# EAGLE design nRF24L01-Chip-v13 (EAGLE 7.7.0)
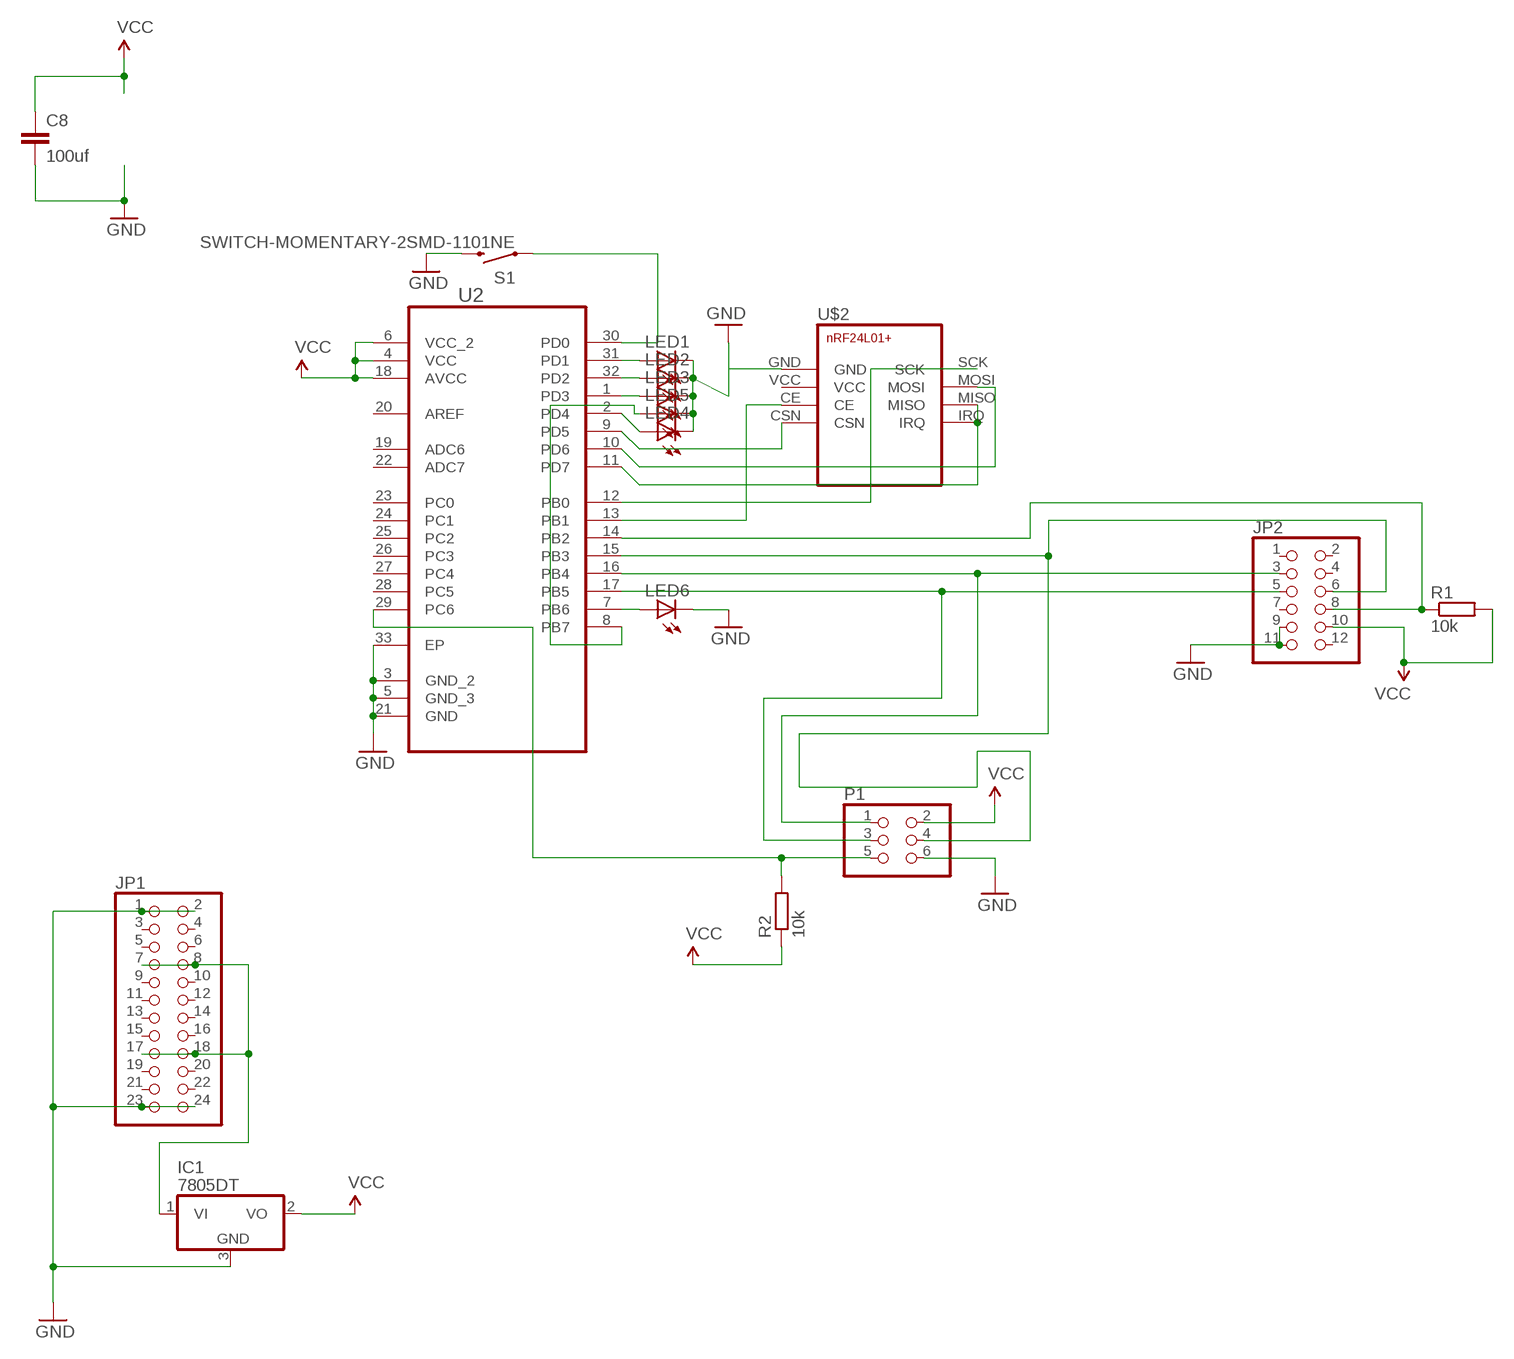
[diagram p0: schematic, sheet 1]

## Parts
C8  100uf  CAP1206  [1206]
IC1  7805DT  [TO252]
JP1  PINHD-2X12SMT  [2X12_SMT]
JP2  PINHD-2X6/90  [2X06/90]
LED1  LED1206  [LED-1206]
LED2  LED1206  [LED-1206]
LED3  LED1206  [LED-1206]
LED4  LED1206  [LED-1206]
LED5  LED1206  [LED-1206]
LED6  LED1206  [LED-1206]
P1  PINHD-2X3SMT  [2X03_SMT]
R1  10k  R-EU_R0402  [R0402]
R2  10k  R-EU_R0402  [R0402]
S1  SWITCH-MOMENTARY-2SMD-1101NE  [TACTILE-SWITCH-1101NE]
U2  ATMEGA328P-MU  [QFN50P500X500X100-33N]
U$2  NRF24L01+  [NRF24L01+]

## Nets
GND: C8.2 IC1.3(GND) JP1.1 JP1.2 JP1.23 JP1.24 JP2.9 JP2.11 LED1.C LED2.C LED3.C LED4.C LED5.C LED6.C P1.6 S1.2 U2.3(GND_2) U2.5(GND_3) U2.21(GND) U2.33(EP) U$2.GND
N$1: IC1.1(VI) JP1.7 JP1.8 JP1.17 JP1.18
N$3: U2.13(PB1) U$2.CE
N$4: U2.12(PB0) U$2.SCK
N$5: U2.11(PD7) U$2.IRQ U$2.MISO
N$6: U2.10(PD6) U$2.MOSI
N$7: U2.9(PD5) U$2.CSN
N$9: LED5.A U2.8(PB7)
N$11: JP2.5 P1.3 U2.17(PB5)
N$12: JP2.6 P1.4 U2.15(PB3)
N$13: JP2.3 P1.1 U2.16(PB4)
N$14: P1.5 R2.2 U2.29(PC6)
N$15: LED6.A U2.7(PB6)
N$16: LED4.A U2.2(PD4)
N$17: LED3.A U2.1(PD3)
N$18: LED2.A U2.32(PD2)
N$19: LED1.A U2.31(PD1)
N$20: S1.1 U2.30(PD0)
N$21: JP2.8 R1.1 U2.14(PB2)
VCC: C8.1 IC1.2(VO) JP2.10 P1.2 R1.2 R2.1 U2.4(VCC) U2.6(VCC_2) U2.18(AVCC)
Unconnected: JP1.3 JP1.4 JP1.5 JP1.6 JP1.9 JP1.10 JP1.11 JP1.12 JP1.13 JP1.14 JP1.15 JP1.16 JP1.19 JP1.20 JP1.21 JP1.22 JP2.1 JP2.2 JP2.4 JP2.7 JP2.12 U2.19(ADC6) U2.20(AREF) U2.22(ADC7) U2.23(PC0) U2.24(PC1) U2.25(PC2) U2.26(PC3) U2.27(PC4) U2.28(PC5)

## Power pins joined to a net without a drawn wire
VCC: U$2.VCC

## Library data of the parts
C8 = SparkFun-Capacitors:CAP: Capacitor Standard 0603 ceramic capacitor, and 0.1" leaded capacitor.
IC1 = linear:78*: Positive VOLTAGE REGULATOR Source: http://cache.national.com/ds/LM/LM78L05.pdf http://www.fairchildsemi.com/ds/LM/LM7805.pdf
JP1 = pinhead+:PINHD-2X12: PIN HEADER
JP2 = pinhead:PINHD-2X6: PIN HEADER
LED1-LED6 = LilyPad-Wearables:LED: LEDs Standard schematic elements and footprints for 5mm, 3mm, 1206, and 0603 sized LEDs. 5mm - Spark Fun Electronics SKU : Comp-SBL
P1 = pinhead+:PINHD-2X3: PIN HEADER
R1 R2 = resistor:R-EU_: RESISTOR, European symbol
S1 = SparkFun-Electromechanical:SWITCH-MOMENTARY-2: Various NO switches- pushbuttons, reed, etc; PROD_ID: SWCH-00815
U2 = Ava:ATMEGA328P-MU: Programmable Flash; MPN: ATMEGA328P-MU; OC_FARNELL: 1748522; OC_NEWARK: 26R2526; PACKAGE: QFN-32; SUPPLIER: Atmel
U$2 = nrf24L01:NRF24L01+: nRF24L01+ Transceiver Module

## Board
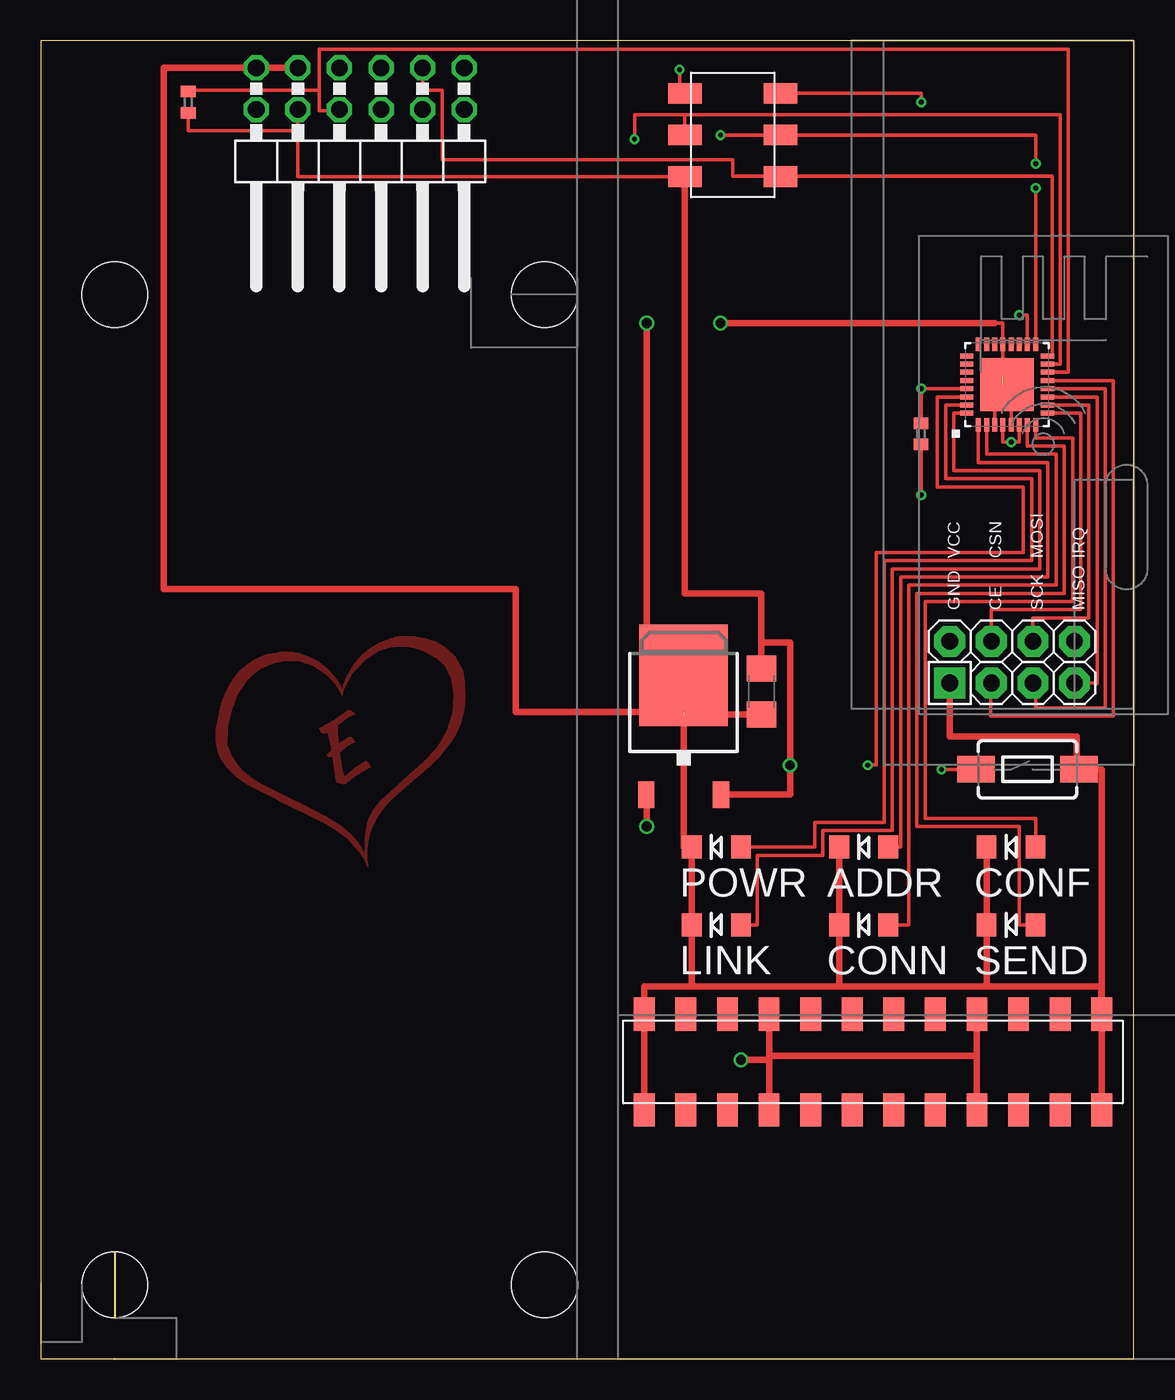
[diagram p1: board, top side]
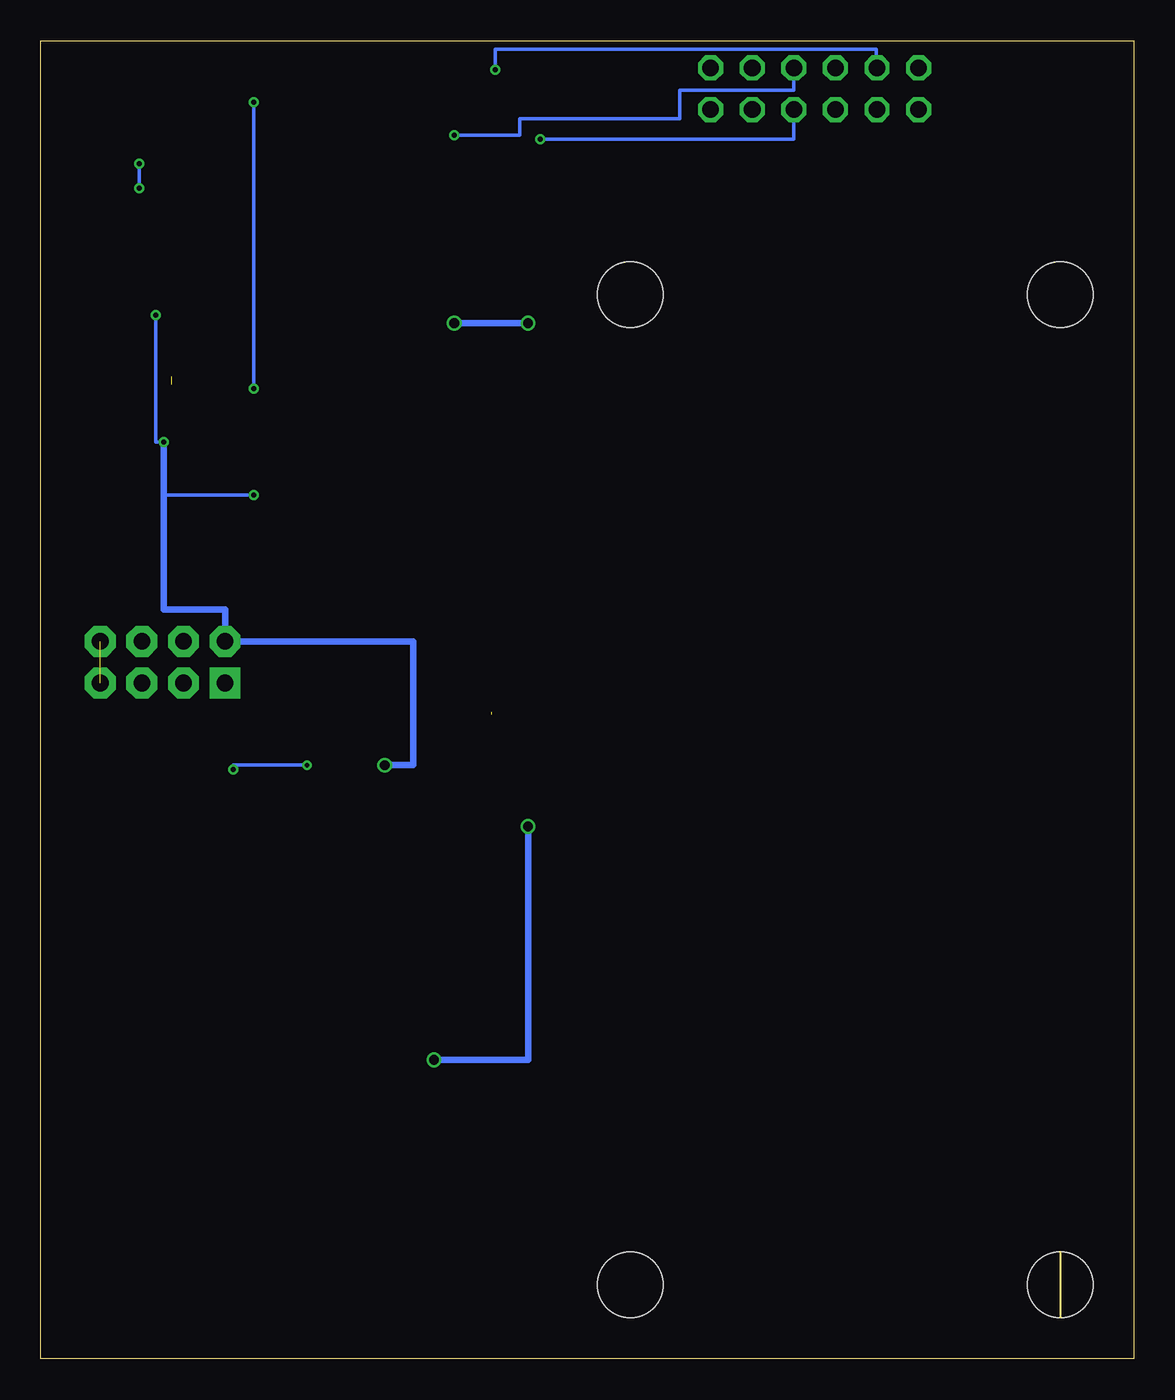
[diagram p2: board, bottom side, seen from below]

Size 66.75 x 80.5 mm. Coordinates in mm from the lower left corner, seen from the top.
Outline: 0,0 66.75,0 66.75,80.5 0,80.5 0,0
Copper layers (1*16): Top 0.035mm / dielectric 1.5mm / Bottom 0.035mm
Design rules "dirt_cheap_dirty_boards.v1": minimum track width 5mil, minimum drill 0.3mm, track to track 6mil, track to pad 6mil, pad to pad 6mil, via to via 6mil, smd to smd 0mil, copper to edge 10mil, drill to drill 10mil, minimum pad ring 10mil, minimum via ring 6mil, stop-mask expansion 2mil, vias tented up to drill 25mil, thermal gap 10mil
Holes 4 mm at 4.5,65 4.5,4.5 30.75,65 30.75,4.5

### Footprints (pad centres in the part's own frame; a part is rotated, then mirrored left to right if it is on the bottom)
1206 = smd 1.6 x 1.8: 1 -1.4,0; 2 1.4,0
TO252 = smd 1 x 1.6: 1 -2.28,-4.8; 2 2.28,-4.8 | smd 5.4 x 6.2: 3 0,2.5
2X12_SMT = smd 1.27 x 2.032: 1 -13.97,-2.921; 2 -13.97,2.921; 3 -11.43,-2.921; 4 -11.43,2.921; 5 -8.89,-2.921; 6 -8.89,2.921; 7 -6.35,-2.921; 8 -6.35,2.921; 9 -3.81,-2.921; 10 -3.81,2.921; 11 -1.27,-2.921; 12 -1.27,2.921; 13 1.27,-2.921; 14 1.27,2.921; 15 3.81,-2.921; 16 3.81,2.921; 17 6.35,-2.921; 18 6.35,2.921; 19 8.89,-2.921; 20 8.89,2.921; 21 11.43,-2.921; 22 11.43,2.921; 23 13.97,-2.921; 24 13.97,2.921
2X06/90 = drill 1.016 octagon: 1 -6.35,-6.35; 2 -6.35,-3.81; 3 -3.81,-6.35; 4 -3.81,-3.81; 5 -1.27,-6.35; 6 -1.27,-3.81; 7 1.27,-6.35; 8 1.27,-3.81; 9 3.81,-6.35; 10 3.81,-3.81; 11 6.35,-6.35; 12 6.35,-3.81
LED-1206 = smd 1.2 x 1.4: A -1.5,0; C 1.5,0
2X03_SMT = smd 1.27 x 2.032: 1 -2.54,-2.921; 2 -2.54,2.921; 3 0,-2.921; 4 0,2.921; 5 2.54,-2.921; 6 2.54,2.921
R0402 = smd 0.7 x 0.9: 1 -0.65,0; 2 0.65,0
TACTILE-SWITCH-1101NE = smd 2.3 x 1.6: 1 -3.15,0; 2 3.15,0
QFN50P500X500X100-33N = smd 0.813 x 0.305: 1 -2.464,1.753; 2 -2.464,1.245; 3 -2.464,0.762; 4 -2.464,0.254; 5 -2.464,-0.254; 6 -2.464,-0.762; 7 -2.464,-1.245; 8 -2.464,-1.753; 17 2.464,-1.753; 18 2.464,-1.245; 19 2.464,-0.762; 20 2.464,-0.254; 21 2.464,0.254; 22 2.464,0.762; 23 2.464,1.245; 24 2.464,1.753 | smd 0.305 x 0.813: 9 -1.753,-2.464; 10 -1.245,-2.464; 11 -0.762,-2.464; 12 -0.254,-2.464; 13 0.254,-2.464; 14 0.762,-2.464; 15 1.245,-2.464; 16 1.753,-2.464; 25 1.753,2.464; 26 1.245,2.464; 27 0.762,2.464; 28 0.254,2.464; 29 -0.254,2.464; 30 -0.762,2.464; 31 -1.245,2.464; 32 -1.753,2.464 | smd 3.251 x 3.251: 33 0,0
NRF24L01+ = drill 1.016 pad 1.88 octagon: CE -11.43,1.27; CSN -8.89,1.27; IRQ -8.89,-3.81; MISO -11.43,-3.81; MOSI -8.89,-1.27; SCK -11.43,-1.27; VCC -8.89,3.81 | drill 1.016 pad 1.88 square: GND -11.43,3.81

### Placement (x,y rotation side)
C8  44,40.75 270 top
IC1  39.25,39.25 0 top
JP1  50.81,18.12 180 top
JP2  19.5,72.5 180 top
LED1  41.25,31.25 180 top
LED2  41.25,26.5 180 top
LED3  50.25,31.25 180 top
LED4  50.25,26.5 180 top
LED5  59.25,31.25 180 top
LED6  59.25,26.5 180 top
P1  42.25,74.75 90 top
R1  9,76.75 270 top
R2  53.75,56.5 90 top
S1  60.25,36 0 top
U2  59,59.5 90 top
U$2  59.31,52.7 90 top

### Tracks (layer width: path | path; a pad name or v marks a point on that pad's centre or on a via)
GND  (via drill 0.3, 0.6)  (2 unrouted)
  Top 0.2: 58.75,60 | U2.3 58.24,59.5 U2.33 | U2.5 59.25,58.5 59.25,59.5 U2.33 | P1.6 39,77.29 v39,78.75 | 58.25,63.25 58.75,63.25 U2.21 58.75,59.5 U2.33
  Top 0.4: JP1.23 36.84,22.75 39.75,22.75 | 39.75,22.75 48.75,22.75 | 48.75,22.75 57.75,22.75 | 57.75,22.75 64.75,22.75 64.75,21.04 JP1.1 | 48.75,22.75 LED4.C LED3.C | 39.25,39.35 39.25,31.25 LED1.C LED2.C 39.75,22.75 | 39.25,39.35 C8.2 | LED5.C LED6.C 57.75,22.75 | 39.25,39.35 39.25,39.5 | 39.25,39.5 IC1.3 37,41.75 v37,63.25 | JP2.9 JP2.11 7.5,78.85 7.5,47 29,47 29,39.5 39.25,39.5 | 58.25,63.25 v41.5,63.25
  Top 0.406: JP1.23 JP1.24 | U$2.GND 55.51,38 63.25,38 63.25,36 S1.2 64.78,36 JP1.1 JP1.2
  Bottom 0.2: v39,78.75 39,80 15.75,80 15.75,78.85 JP2.9
  Bottom 0.4: v41.5,63.25 v37,63.25
N$1  (via drill 0.6)
  Top 0.4: JP1.18 44.47,18.25 | 44.47,18.25 44.47,18.5 | 44.47,18.5 57.16,18.5 | JP1.17 44.47,18.5 | IC1.1 37,34.45 v37,32.5 | v42.75,18.25 44.47,18.25
  Top 0.406: JP1.7 57.16,18.5 JP1.8
  Bottom 0.4: v37,32.5 37,18.25 v42.75,18.25
N$3
  Top 0.2: U$2.CE 58,41.27 58,39.25 65.5,39.25 65.5,59.75 U2.13
N$4
  Top 0.2: U$2.SCK 60.75,41.27 60.75,39.75 65,39.75 65,59.25 U2.12
N$5  (1 unrouted)
  Top 0.2: U$2.MISO 64.5,41.27 | 64.5,41.27 64.5,41.25 | 64.5,41.27 64.5,58.75 U2.11
N$6
  Top 0.2: U$2.MOSI 60.59,45.25 64,45.25 64,58.24 61.46,58.24 U2.10
N$7
  Top 0.2: U$2.CSN 58.05,45.75 63.5,45.75 63.5,57.76 U2.9
N$8
  pour Top: 316 corners
  pour Top: 18.39,40.51 18.36,40.51 18.33,40.63 18.3,40.68 18.27,40.73 18.25,40.78 18.23,40.83 18.18,40.91 18.13,40.99 18.07,41.09 18.01,41.16 17.97,41.21 17.92,41.28 17.83,41.38 17.75,41.49 17.56,41.66 17.41,41.82 17.2,41.95 17.07,42.03 16.95,42.11 16.81,42.2 16.66,42.3 16.5,42.38 16.31,42.45 16.13,42.51 15.91,42.58 15.69,42.63 15.46,42.65 14.95,42.65 14.66,42.63 14.37,42.53 14.19,42.48 13.98,42.45 13.56,42.25 13.23,42.06 12.98,41.83 12.64,41.5 12.35,41.09 12.09,40.7 11.94,40.42 11.8,40 11.68,39.7 11.57,39.26 11.51,38.96 11.45,38.72 11.41,38.5 11.4,38.18 11.38,37.77 11.39,37.48 11.64,36.8 11.85,36.48 12.26,35.97 12.61,35.67 13.08,35.32 13.51,35.07 14.38,34.63 15.23,34.22 16.04,33.81 16.7,33.5 17.38,33.13 17.84,32.85 18.32,32.58 18.93,32.04 19.37,31.53 19.66,31.07 19.8,30.73 19.78,31.06 19.77,31.88 19.95,32.84 20.28,33.47 20.76,34.1 21.37,34.65 22.47,35.66 23.39,36.48 24.18,37.31 24.58,37.94 24.83,38.42 25.14,39.47 25.22,40.59 25.07,41.56 24.65,42.33 24.15,42.79 23.75,43.03 23.35,43.23 22.79,43.4 22.42,43.46 21.9,43.49 21.29,43.44 20.74,43.26 20.47,43.13 20.08,42.87 19.82,42.69 19.54,42.39 19.21,42.05 19.02,41.84 18.89,41.62 18.77,41.39 18.58,41.02 18.51,40.84 18.39,40.89 18.49,41.24 18.63,41.61 19.15,42.46 19.59,42.98 20.08,43.37 20.63,43.72 21.23,43.97 21.86,44.13 22.85,44.1 23.51,43.98 24.11,43.8 24.74,43.42 25.29,42.89 25.75,42.05 25.88,41.35 25.93,40.3 25.85,39.64 25.64,38.79 25.32,38.1 24.93,37.51 24.35,36.79 23.73,36.18 22.99,35.54 22.02,34.7 21.51,34.24 21.13,33.86 20.9,33.57 20.57,33.11 20.31,32.61 20.1,32.15 19.98,31.63 19.92,31.17 19.94,30.51 19.97,30.13 19.98,30.01 19.94,30.08 19.73,30.52 19.44,30.95 19.2,31.24 18.72,31.74 18.27,32.09 17.95,32.32 17.67,32.51 17.21,32.76 16.31,33.2 14.65,34 14.3,34.21 13.68,34.51 13.25,34.75 12.66,35.06 12.24,35.32 11.92,35.54 11.67,35.76 11.35,36.11 11.09,36.47 10.96,36.69 10.84,36.99 10.72,37.39 10.67,37.77 10.67,38.39 10.82,39.17 10.96,39.79 11.11,40.26 11.26,40.63 11.44,41.02 11.71,41.47 12.15,42.03 12.6,42.41 13.02,42.7 13.72,43 14.33,43.12 14.71,43.18 15.33,43.17 15.73,43.1 16.09,42.99 16.47,42.84 16.9,42.61 17.3,42.32 17.56,42.09 17.93,41.71 18.2,41.31 18.39,40.51
  pour Top: 18.22,41.26 18.39,40.89 18.51,40.85 18.47,40.77 18.44,40.64 18.41,40.54 18.4,40.5 18.28,40.69 18.17,40.92 18.04,41.11 17.94,41.24 17.79,41.42 17.54,41.68 17.28,41.88 16.76,42.26 16.41,42.39 16.17,42.48 15.94,42.56 15.68,42.6 15.52,42.62 14.92,42.62 14.59,42.56 14.22,42.48 13.82,42.32 13.41,42.12 13.16,41.95 13.01,41.83 12.62,41.45 12.28,41.84 13.39,42.59 14.71,42.89 16.32,42.72 17.51,41.95 18.22,41.25
  pour Top: 18.22,41.26 18.39,40.89 18.51,40.85 18.47,40.77 18.44,40.64 18.41,40.54 18.4,40.5 18.28,40.69 18.17,40.92 18.04,41.11 17.94,41.24 17.79,41.42 17.54,41.68 17.28,41.88 16.76,42.26 16.41,42.39 16.17,42.48 15.94,42.56 15.68,42.6 15.52,42.62 14.92,42.62 14.59,42.56 14.22,42.48 13.82,42.32 13.41,42.12 13.16,41.95 13.01,41.83 12.62,41.45 12.28,41.84 13.39,42.59 14.71,42.89 16.32,42.72 17.51,41.95 18.22,41.25
N$9
  Top 0.2: LED5.A 60.75,33 54,33 54,46.25 63,46.25 63,56.25 60.75,56.25 U2.8
N$11  (via drill 0.3)
  Top 0.2: v60.75,73 60.75,74.75 P1.3 v41.5,74.75 | v60.75,71.5 U2.17
  Bottom 0.2: v60.75,73 v60.75,71.5 | JP2.5 20.77,77.5 27.75,77.5 27.75,75.75 37.5,75.75 37.5,74.75 v41.5,74.75
N$12  (via drill 0.3)
  Top 0.2: U2.15 62.25,60.74 62.25,76 39.33,76 | 39.33,76 P1.4 | 39.33,76 36.25,76 v36.25,74.5
  Bottom 0.2: v36.25,74.5 20.77,74.5 JP2.6
N$13
  Top 0.2: U2.16 61.75,61.25 61.75,72.25 45.17,72.25 | 45.17,72.25 P1.1 | 45.17,72.25 42.25,72.25 42.25,73.25 24.5,73.25 24.5,77.5 23.31,77.5 JP2.3
N$14  (via drill 0.3)
  Top 0.2: P1.5 53.75,77.29 v53.75,76.75 | U2.29 v53.75,59.25 R2.2
  Bottom 0.2: v53.75,76.75 v53.75,59.25
N$15
  Top 0.2: LED6.A 59.75,26.5 59.75,32.5 53.5,32.5 53.5,46.75 62.5,46.75 62.5,55.75 60.24,55.75 U2.7
N$16
  Top 0.2: LED4.A 53,26.5 53,47.25 62,47.25 62,55.25 57.76,55.25 U2.2
N$17
  Top 0.2: LED3.A 52.5,31.25 52.5,47.75 61.5,47.75 61.5,54.75 57.25,54.75 U2.1
N$18
  Top 0.2: LED2.A 43.75,26.5 43.75,30.75 47.75,30.75 47.75,32.25 52,32.25 52,48.25 61,48.25 61,54.25 55.75,54.25 55.75,57.75 U2.32
N$19
  Top 0.2: LED1.A 47.25,31.25 47.25,32.75 51.5,32.75 51.5,48.75 60.5,48.75 60.5,53.75 55.25,53.75 55.25,58.26 U2.31
N$20  (via drill 0.3)
  Top 0.2: S1.1 v55,36 | v50.5,36.25 51,36.25 51,49.25 60,49.25 60,53.25 54.75,53.25 54.75,58.74 U2.30
  Bottom 0.2: v55,36 55,36.25 v50.5,36.25
N$21
  Top 0.2: U2.14 62.75,60.26 62.75,80 17,80 17,77.5 | 17,77.5 17,76.25 18.23,76.25 JP2.8 | 17,77.5 9,77.5 R1.1
VCC  (via drill 0.3, 0.6)
  Top 0.2: U2.18 60.24,63.75 v59.75,63.75 | U2.4 58.75,56 v59.25,56 59.76,56 U2.6 | P1.2 15.69,72.21 15.69,75 | 15.69,75 JP2.10 | R2.1 v53.75,52.75 | R1.2 9,75 15.69,75
  Top 0.4: IC1.2 45.75,34.45 v45.75,36.25 45.75,43.75 44,43.75 | 55.51,43.75 U$2.VCC | C8.1 44,43.75 | P1.2 39.33,46.75 44,46.75 44,43.75
  Bottom 0.2: v59.75,63.75 59.75,56 v59.25,56 | v53.75,52.75 59.25,52.75
  Bottom 0.4: v45.75,36.25 44,36.25 44,43.81 U$2.VCC 55.51,45.75 59.25,45.75 59.25,52.75 v59.25,56

### Text on the board
tPlace: POWR | ADDR | CONF | LINK | CONN | SEND